# EAGLE design PCB-ATEM-GPITBO2 (EAGLE 6.5.0)

## Sheet 1 of 2
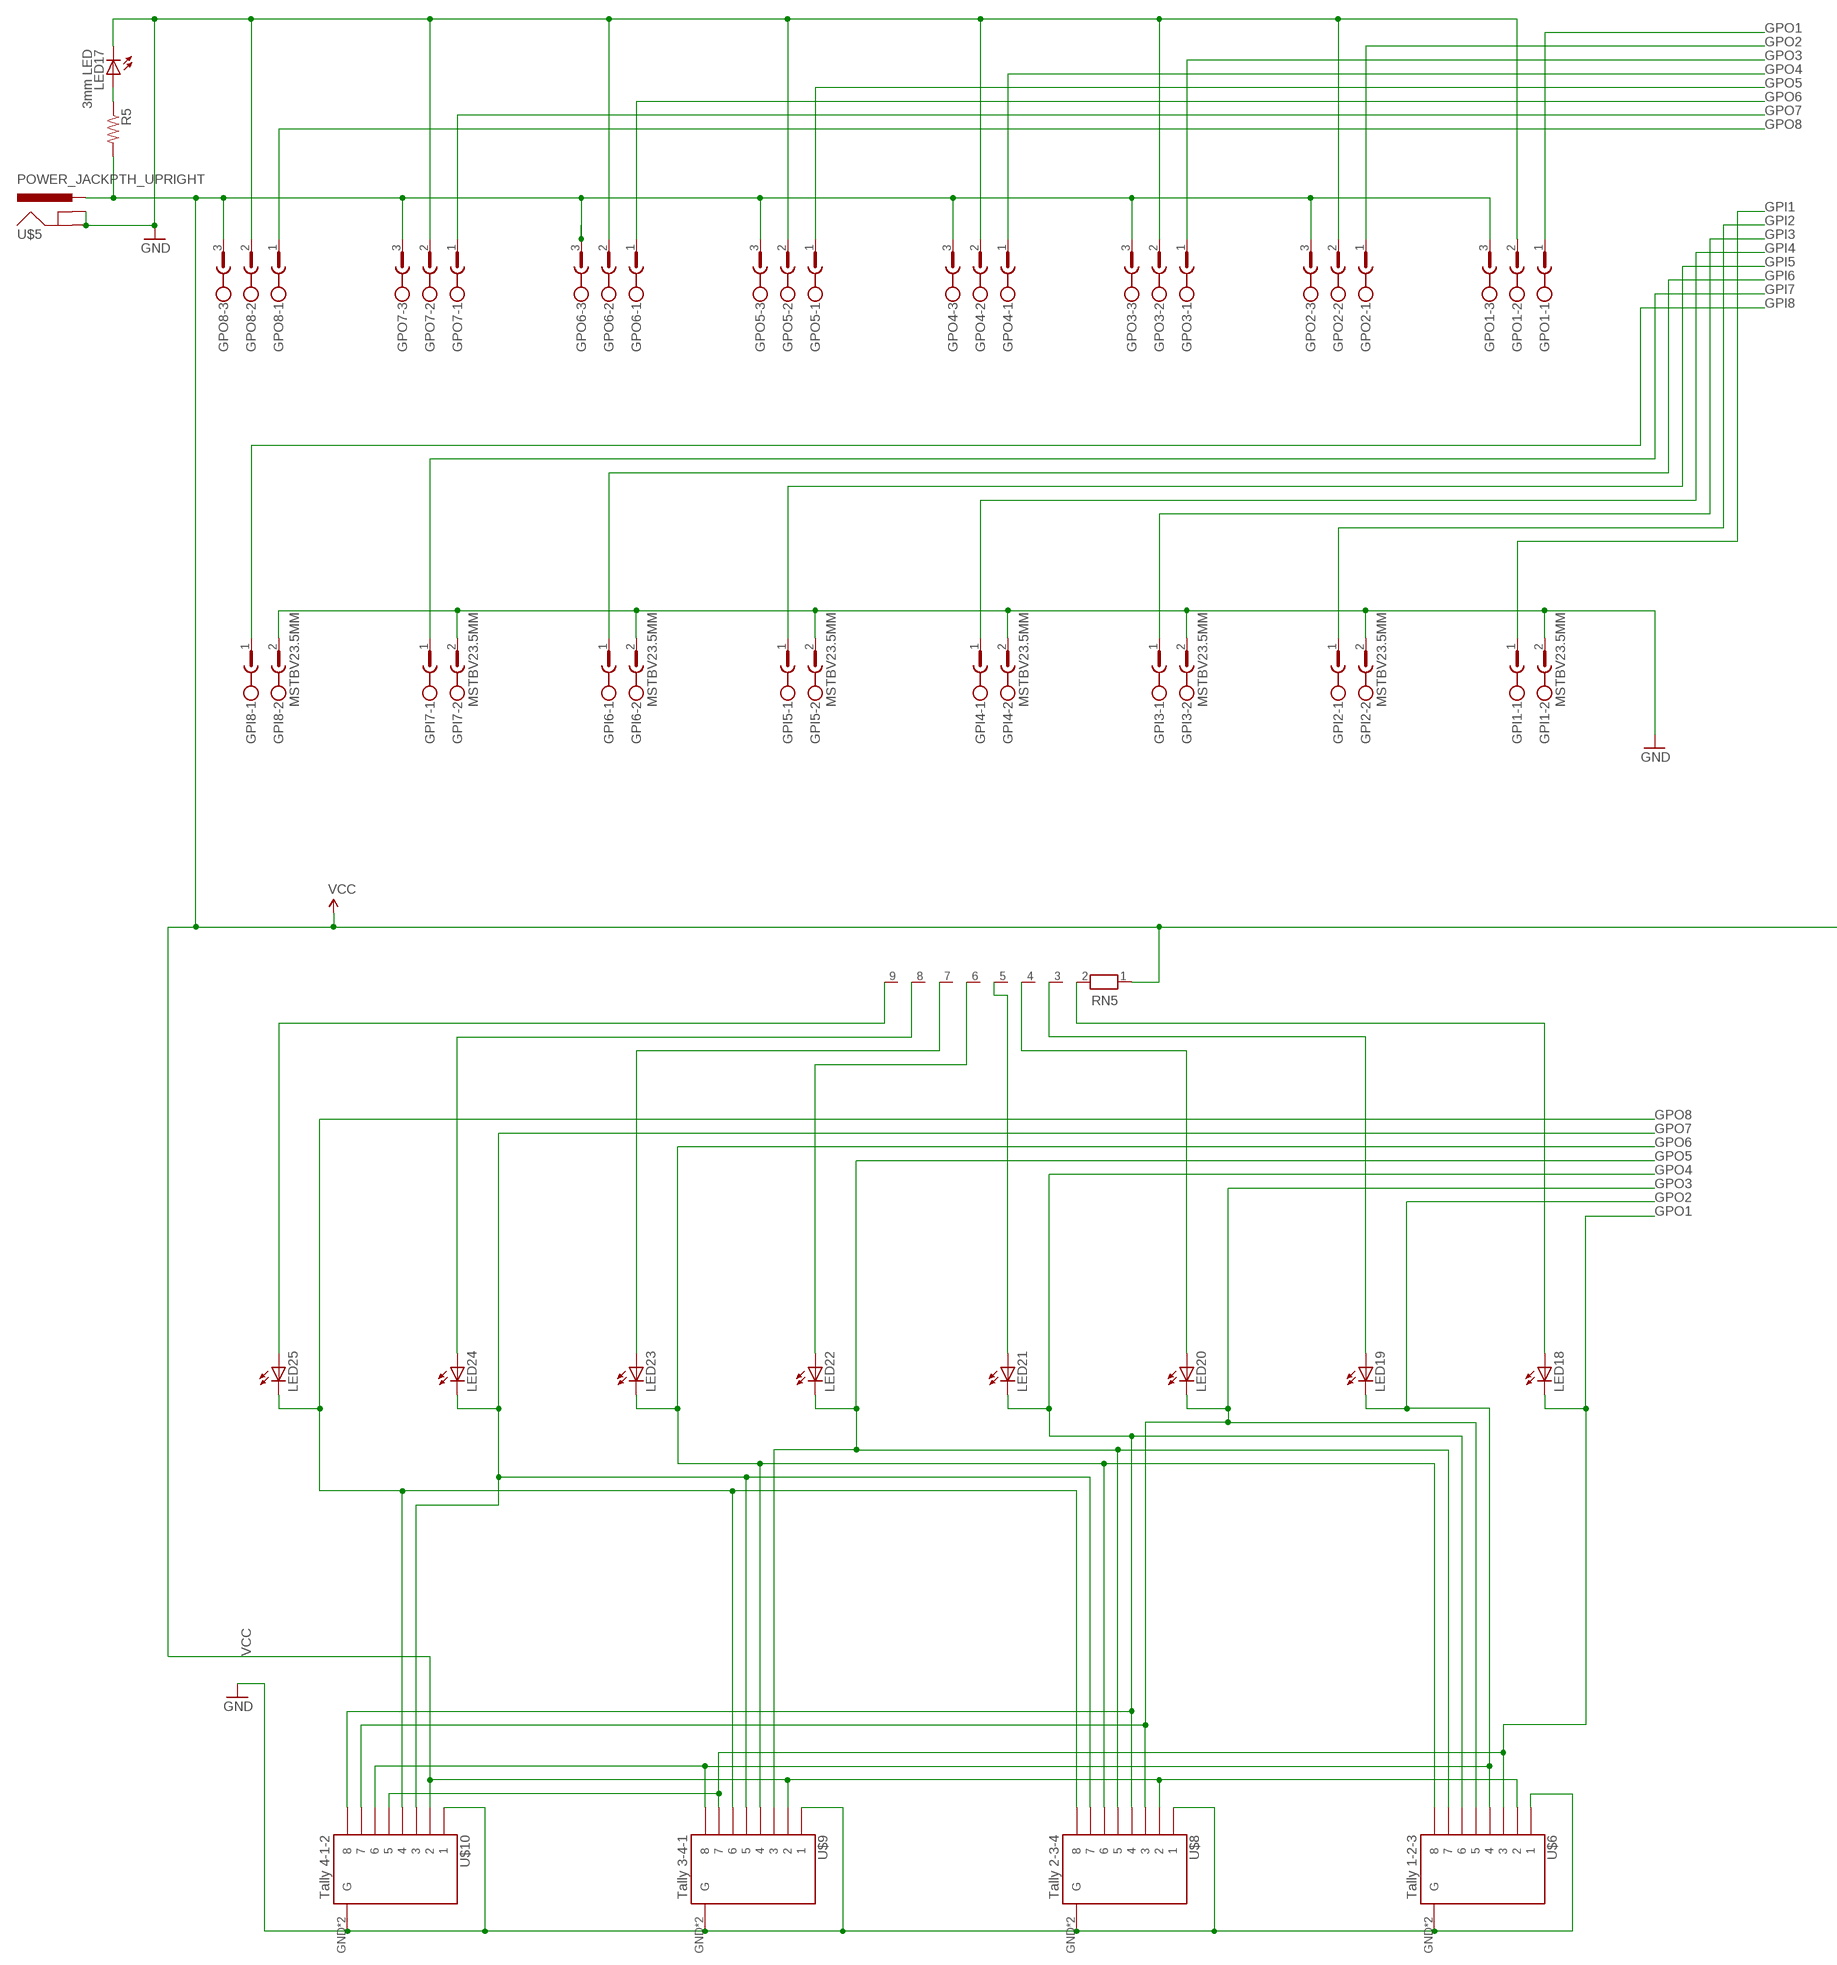
[diagram p0: schematic, sheet 1, part 1 of 2]
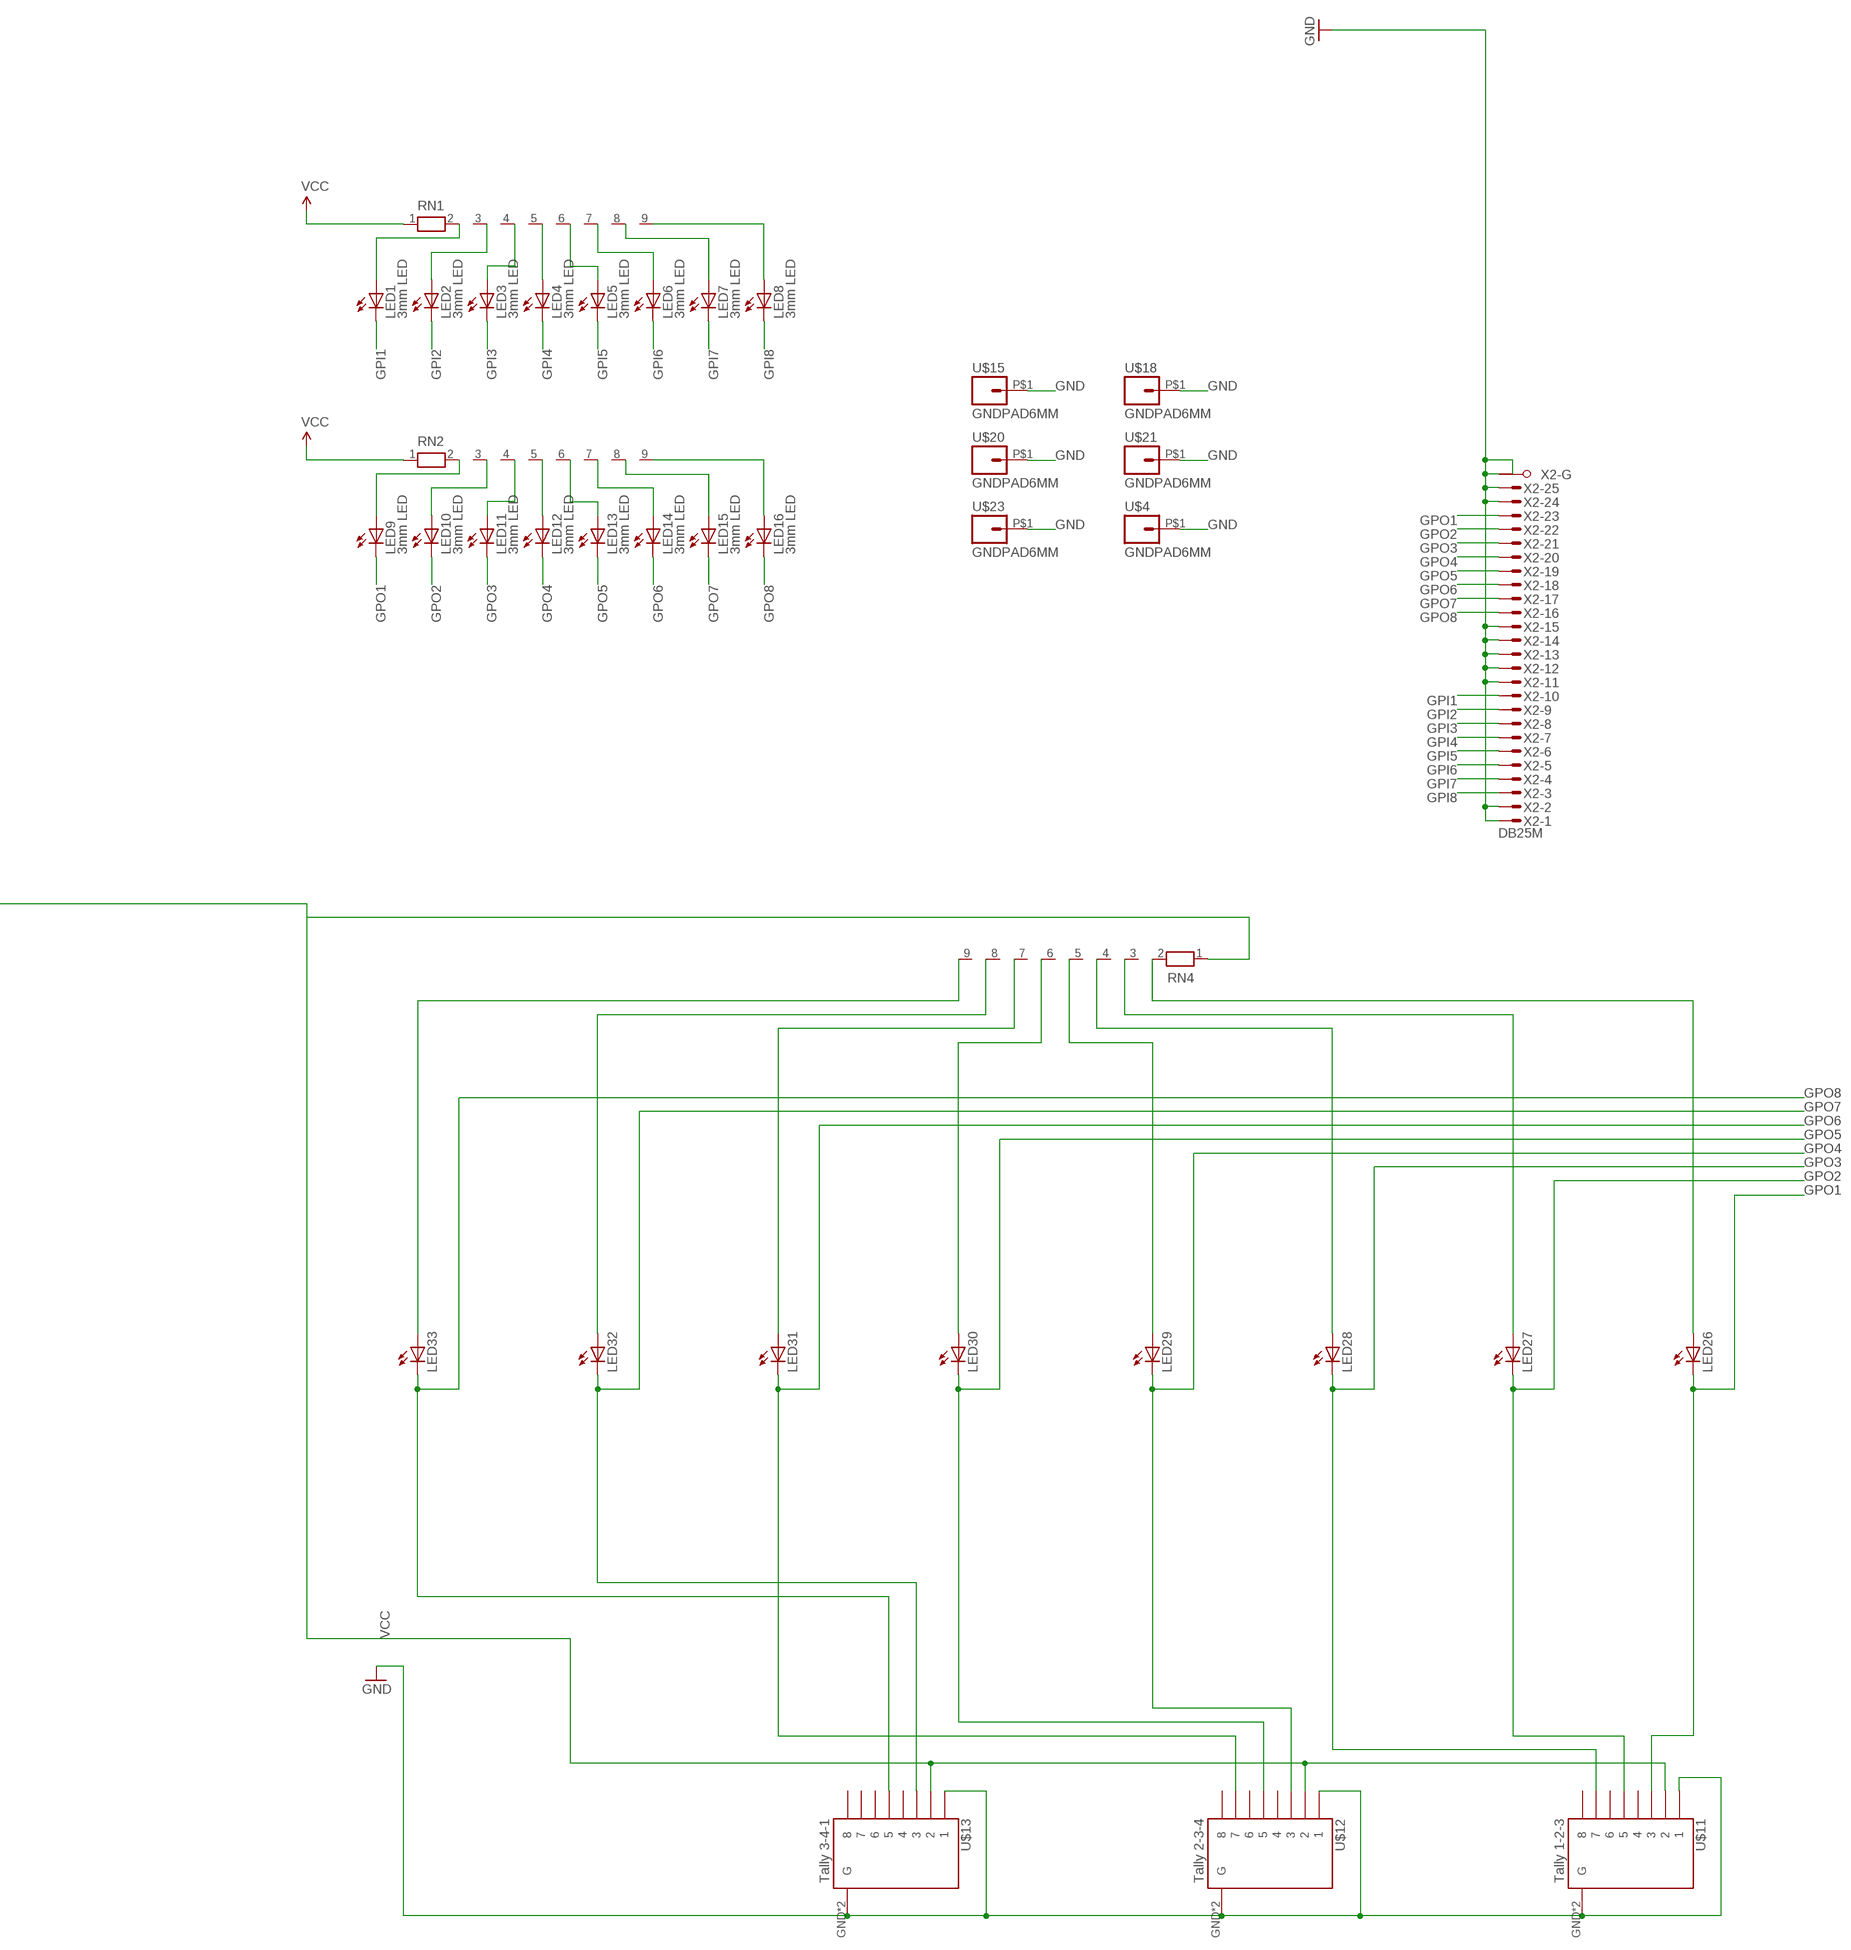
[diagram p1: schematic, sheet 1, part 2 of 2]

### Parts
GPI1  MSTBV23.5MM  [MSTBV2-3.5]
GPI2  MSTBV23.5MM  [MSTBV2-3.5]
GPI3  MSTBV23.5MM  [MSTBV2-3.5]
GPI4  MSTBV23.5MM  [MSTBV2-3.5]
GPI5  MSTBV23.5MM  [MSTBV2-3.5]
GPI6  MSTBV23.5MM  [MSTBV2-3.5]
GPI7  MSTBV23.5MM  [MSTBV2-3.5]
GPI8  MSTBV23.5MM  [MSTBV2-3.5]
GPO1  CON1  MSTBV33.5MM  [MSTBV3-3.5]
GPO2  CON1  MSTBV33.5MM  [MSTBV3-3.5]
GPO3  CON1  MSTBV33.5MM  [MSTBV3-3.5]
GPO4  CON1  MSTBV33.5MM  [MSTBV3-3.5]
GPO5  CON1  MSTBV33.5MM  [MSTBV3-3.5]
GPO6  CON1  MSTBV33.5MM  [MSTBV3-3.5]
GPO7  CON1  MSTBV33.5MM  [MSTBV3-3.5]
GPO8  CON1  MSTBV33.5MM  [MSTBV3-3.5]
LED1  3mm LED  LED3MM  [LED3MM]
LED2  3mm LED  LED3MM  [LED3MM]
LED3  3mm LED  LED3MM  [LED3MM]
LED4  3mm LED  LED3MM  [LED3MM]
LED5  3mm LED  LED3MM  [LED3MM]
LED6  3mm LED  LED3MM  [LED3MM]
LED7  3mm LED  LED3MM  [LED3MM]
LED8  3mm LED  LED3MM  [LED3MM]
LED9  3mm LED  LED3MM  [LED3MM]
LED10  3mm LED  LED3MM  [LED3MM]
LED11  3mm LED  LED3MM  [LED3MM]
LED12  3mm LED  LED3MM  [LED3MM]
LED13  3mm LED  LED3MM  [LED3MM]
LED14  3mm LED  LED3MM  [LED3MM]
LED15  3mm LED  LED3MM  [LED3MM]
LED16  3mm LED  LED3MM  [LED3MM]
LED17  3mm LED  LED3MM  [LED3MM]
LED18  LED3MM  [LED3MM]
LED19  LED3MM  [LED3MM]
LED20  LED3MM  [LED3MM]
LED21  LED3MM  [LED3MM]
LED22  LED3MM  [LED3MM]
LED23  LED3MM  [LED3MM]
LED24  LED3MM  [LED3MM]
LED25  LED3MM  [LED3MM]
LED26  LED3MM  [LED3MM]
LED27  LED3MM  [LED3MM]
LED28  LED3MM  [LED3MM]
LED29  LED3MM  [LED3MM]
LED30  LED3MM  [LED3MM]
LED31  LED3MM  [LED3MM]
LED32  LED3MM  [LED3MM]
LED33  LED3MM  [LED3MM]
R5  RESISTOR0603-RES  [0603-RES]
RN1  RN08  [RN-9]
RN2  RN08  [RN-9]
RN4  RN08  [RN-9]
RN5  RN08  [RN-9]
U$4  GNDPAD6MM  [3.2MMPAD6MM]
U$5  POWER_JACKPTH_UPRIGHT  [POWER_JACK_PTH_UPRIGHT]
U$6  Tally 1-2-3  RJ45-8_GNDUPRIGHT  [RJ45-8_GND_UPRIGHT]
U$8  Tally 2-3-4  RJ45-8_GNDUPRIGHT  [RJ45-8_GND_UPRIGHT]
U$9  Tally 3-4-1  RJ45-8_GNDUPRIGHT  [RJ45-8_GND_UPRIGHT]
U$10  Tally 4-1-2  RJ45-8_GNDUPRIGHT  [RJ45-8_GND_UPRIGHT]
U$11  Tally 1-2-3  RJ45-8_GNDUPRIGHT  [RJ45-8_GND_UPRIGHT]
U$12  Tally 2-3-4  RJ45-8_GNDUPRIGHT  [RJ45-8_GND_UPRIGHT]
U$13  Tally 3-4-1  RJ45-8_GNDUPRIGHT  [RJ45-8_GND_UPRIGHT]
U$15  GNDPAD6MM  [3.2MMPAD6MM]
U$18  GNDPAD6MM  [3.2MMPAD6MM]
U$20  GNDPAD6MM  [3.2MMPAD6MM]
U$21  GNDPAD6MM  [3.2MMPAD6MM]
U$23  GNDPAD6MM  [3.2MMPAD6MM]
X2  DB25M  M25HPS  [M25HP]

### Nets
GND [PWR]: GPI1.2 GPI2.2 GPI3.2 GPI4.2 GPI5.2 GPI6.2 GPI7.2 GPI8.2 GPO1.2 GPO2.2 GPO3.2 GPO4.2 GPO5.2 GPO6.2 GPO7.2 GPO8.2 LED17.K(C) U$4.P$1 U$5.GND U$5.SHUNT(GNDBREAK) U$6.1 U$6.GND1(G) U$6.GND(G) U$8.1 U$8.GND1(G) U$8.GND(G) U$9.1 U$9.GND1(G) U$9.GND(G) U$10.1 U$10.GND1(G) U$10.GND(G) U$11.1 U$11.GND1(G) U$11.GND(G) U$12.1 U$12.GND1(G) U$12.GND(G) U$13.1 U$13.GND1(G) U$13.GND(G) U$15.P$1 U$18.P$1 U$20.P$1 U$21.P$1 U$23.P$1 X2.1(-1:M) X2.2(-2:M) X2.11(-11:M) X2.12(-12:M) X2.13(-13:M) X2.14(-14:M) X2.15(-15:M) X2.24(-24:M) X2.25(-25:M) X2.G1(-G:G1) X2.G2(-G:G2)
GPI1 [INput lines]: GPI1.1 LED1.K(C) X2.10(-10:M)
GPI2 [INput lines]: GPI2.1 LED2.K(C) X2.9(-9:M)
GPI3 [INput lines]: GPI3.1 LED3.K(C) X2.8(-8:M)
GPI4 [INput lines]: GPI4.1 LED4.K(C) X2.7(-7:M)
GPI5 [INput lines]: GPI5.1 LED5.K(C) X2.6(-6:M)
GPI6 [INput lines]: GPI6.1 LED6.K(C) X2.5(-5:M)
GPI7 [INput lines]: GPI7.1 LED7.K(C) X2.4(-4:M)
GPI8 [INput lines]: GPI8.1 LED8.K(C) X2.3(-3:M)
GPO1 [RELAY LINES]: GPO1.1 LED9.K(C) LED18.K(C) LED26.K(C) U$6.3 U$9.7 U$10.5 U$11.3 X2.23(-23:M)
GPO2 [RELAY LINES]: GPO2.1 LED10.K(C) LED19.K(C) LED27.K(C) U$6.4 U$9.8 U$10.6 U$11.5 X2.22(-22:M)
GPO3 [RELAY LINES]: GPO3.1 LED11.K(C) LED20.K(C) LED28.K(C) U$6.5 U$8.3 U$10.7 U$11.7 X2.21(-21:M)
GPO4 [RELAY LINES]: GPO4.1 LED12.K(C) LED21.K(C) LED29.K(C) U$6.6 U$8.4 U$10.8 U$12.3 X2.20(-20:M)
GPO5 [RELAY LINES]: GPO5.1 LED13.K(C) LED22.K(C) LED30.K(C) U$6.7 U$8.5 U$9.3 U$12.5 X2.19(-19:M)
GPO6 [RELAY LINES]: GPO6.1 LED14.K(C) LED23.K(C) LED31.K(C) U$6.8 U$8.6 U$9.4 U$12.7 X2.18(-18:M)
GPO7 [RELAY LINES]: GPO7.1 LED15.K(C) LED24.K(C) LED32.K(C) U$8.7 U$9.5 U$10.3 U$13.3 X2.17(-17:M)
GPO8 [RELAY LINES]: GPO8.1 LED16.K(C) LED25.K(C) LED33.K(C) U$8.8 U$9.6 U$10.4 U$13.5 X2.16(-16:M)
N$1: LED1.A RN1.2
N$2: LED2.A RN1.3
N$4: LED18.A RN5.2
N$6: LED3.A RN1.4
N$9: LED19.A RN5.3
N$10: LED4.A RN1.5
N$13: LED20.A RN5.4
N$14: LED5.A RN1.6
N$15: LED6.A RN1.7
N$16: LED7.A RN1.8
N$17: LED21.A RN5.5
N$18: LED8.A RN1.9
N$19: LED9.A RN2.2
N$20: LED10.A RN2.3
N$21: LED22.A RN5.6
N$22: LED11.A RN2.4
N$23: LED12.A RN2.5
N$24: LED13.A RN2.6
N$25: LED23.A RN5.7
N$26: LED14.A RN2.7
N$27: LED15.A RN2.8
N$28: LED16.A RN2.9
N$29: LED24.A RN5.8
N$30: LED17.A R5.1
N$31: LED25.A RN5.9
N$32: LED26.A RN4.2
N$33: LED27.A RN4.3
N$41: LED28.A RN4.4
N$42: LED29.A RN4.5
N$43: LED30.A RN4.6
N$44: LED31.A RN4.7
N$46: LED32.A RN4.8
N$47: LED33.A RN4.9
VCC: GPO1.3 GPO2.3 GPO3.3 GPO4.3 GPO5.3 GPO6.3 GPO7.3 GPO8.3 R5.2 RN1.1 RN2.1 RN4.1 RN5.1 U$5.PWR U$6.2 U$8.2 U$9.2 U$10.2 U$11.2 U$12.2 U$13.2
Unconnected: U$11.4 U$11.6 U$11.8 U$12.4 U$12.6 U$12.8 U$13.4 U$13.6 U$13.7 U$13.8

## Sheet 2 of 2

## Library data of the parts
GPI1-GPI8 = SKAARHOJ:MSTBV2: PHOENIX
GPO1-GPO8 = SKAARHOJ:MSTBV3: PHOENIX
LED1-LED17 = SKAARHOJ:LED: KINGBRIGHT 20MM BIG LAMP
LED18-LED33 = led:LED: LED OSRAM: - CHIPLED LG R971, LG N971, LY N971, LG Q971, LY Q971, LO R971, LY R971 LH N974, LH R974 LS Q976, LO Q976, LY Q976 LO Q996 - Hyper CHIPLED LW Q18S LB Q993, LB Q99A, LB R99A - SideLED LS A670, LO A670, LY A670, LG A670, LP A670 LB A673, LV A673, LT A673, LW A673 LH A674 LY A675 LS A676, LA A676, LO A676, LY A676, LW A676 LS A679, LY A679, LG A679 - Hyper Micro SIDELED® LS Y876, LA Y876, LO Y876, LY Y876 LT Y87S - SmartLED LW L88C, LW L88S LB L89C, LB L89S, LG L890 LS L89K, LO L89K, LY L89K LS L896, LA L896, LO L896, LY L896 - TOPLED LS T670, LO T670, LY T670, LG T670, LP T670 LSG T670, LSP T670, LSY T670, LOP T670, LYG T670 LG T671, LOG T671, LSG T671 LB T673, LV T673, LT T673, LW T673 LH T674 LS T676, LA T676, LO T676, LY T676, LB T676, LH T676, LSB T676, LW T676 LB T67C, LV T67C, LT T67C, LS T67K, LO T67K, LY T67K, LW E67C LS E67B, LA E67B, LO E67B, LY E67B, LB E67C, LV E67C, LT E67C LW T67C LS T679, LY T679, LG T679 LS T770, LO T770, LY T770, LG T770, LP T770 LB T773, LV T773, LT T773, LW T773 LH T774 LS E675, LA E675, LY E675, LS T675 LS T776, LA T776, LO T776, LY T776, LB T776 LHGB T686 LT T68C, LB T68C - Hyper Mini TOPLED® LB M676 - Mini TOPLED Santana® LG M470 LS M47K, LO M47K, LY M47K Source: http://www.osram.convergy.de LUXEON: - LUMILED® LXK2-PW12-R00, LXK2-PW12-S00, LXK2-PW14-U00, LXK2-PW14-V00 LXK2-PM12-R00, LXK2-PM12-S00, LXK2-PM14-U00 LXK2-PE12-Q00, LXK2-PE12-R00, LXK2-PE12-S00, LXK2-PE14-T00, LXK2-PE14-U00 LXK2-PB12-K00, LXK2-PB12-L00, LXK2-PB12-M00, LXK2-PB14-N00, LXK2-PB14-P00, LXK2-PB14-Q00 LXK2-PR12-L00, LXK2-PR12-M00, LXK2-PR14-Q00, LXK2-PR14-R00 LXK2-PD12-Q00, LXK2-PD12-R00, LXK2-PD12-S00 LXK2-PH12-R00, LXK2-PH12-S00 LXK2-PL12-P00, LXK2-PL12-Q00, LXK2-PL12-R00 Source: www.luxeon.com KINGBRIGHT: KA-3528ASYC Source: www.kingbright.com
R5 = SparkFun:RESISTOR: Resistor Basic schematic elements and footprints for 0603, 1206, and PTH resistors.
RN1 RN2 RN4 RN5 = SKAARHOJ:RN08: RESISTOR NETWORK; OC_FARNELL: unknown; OC_NEWARK: unknown
U$4 U$15 U$18 U$20 U$21 U$23 = SKAARHOJ:GNDPAD
U$5 = SKAARHOJ:POWER_JACK: RASM712PX Right Angle SMT Mount DC Power Jack, pin size 0.100"(2.5mm), with locating post Switchcraft.com
U$6 U$8-U$13 = SKAARHOJ:RJ45-8_GND
X2 = con-subd:M25HPS: SUB-D; OC_FARNELL: unknown; OC_NEWARK: unknown

## Net classes
0 default: width 0.305 mm, drill 0.406 mm, clearance 0.203 mm
1 PWR: width 0.508 mm, drill 0.61 mm, clearance 0.203 mm
2 RELAY LINES: width 0.508 mm, drill 0.61 mm, clearance 0.406 mm
3 INput lines: width 0.305 mm, drill 0.406 mm, clearance 0.305 mm

## Board
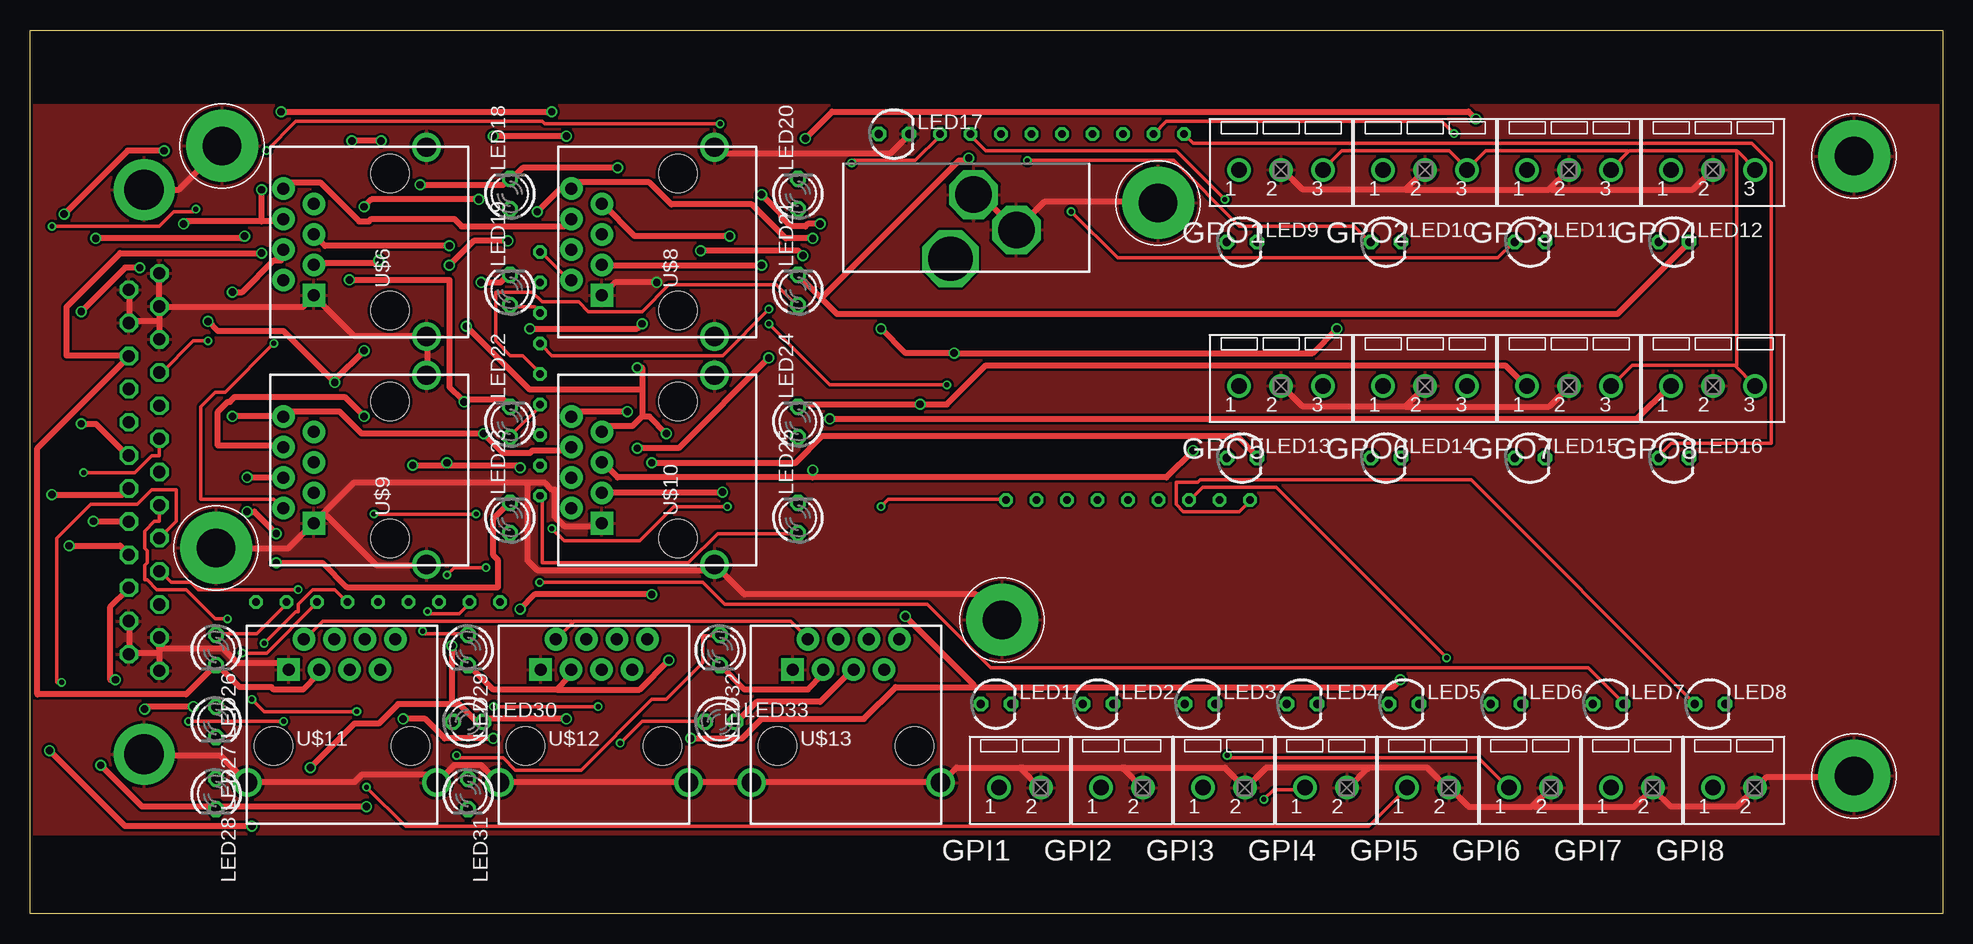
[diagram p2: board, top side]
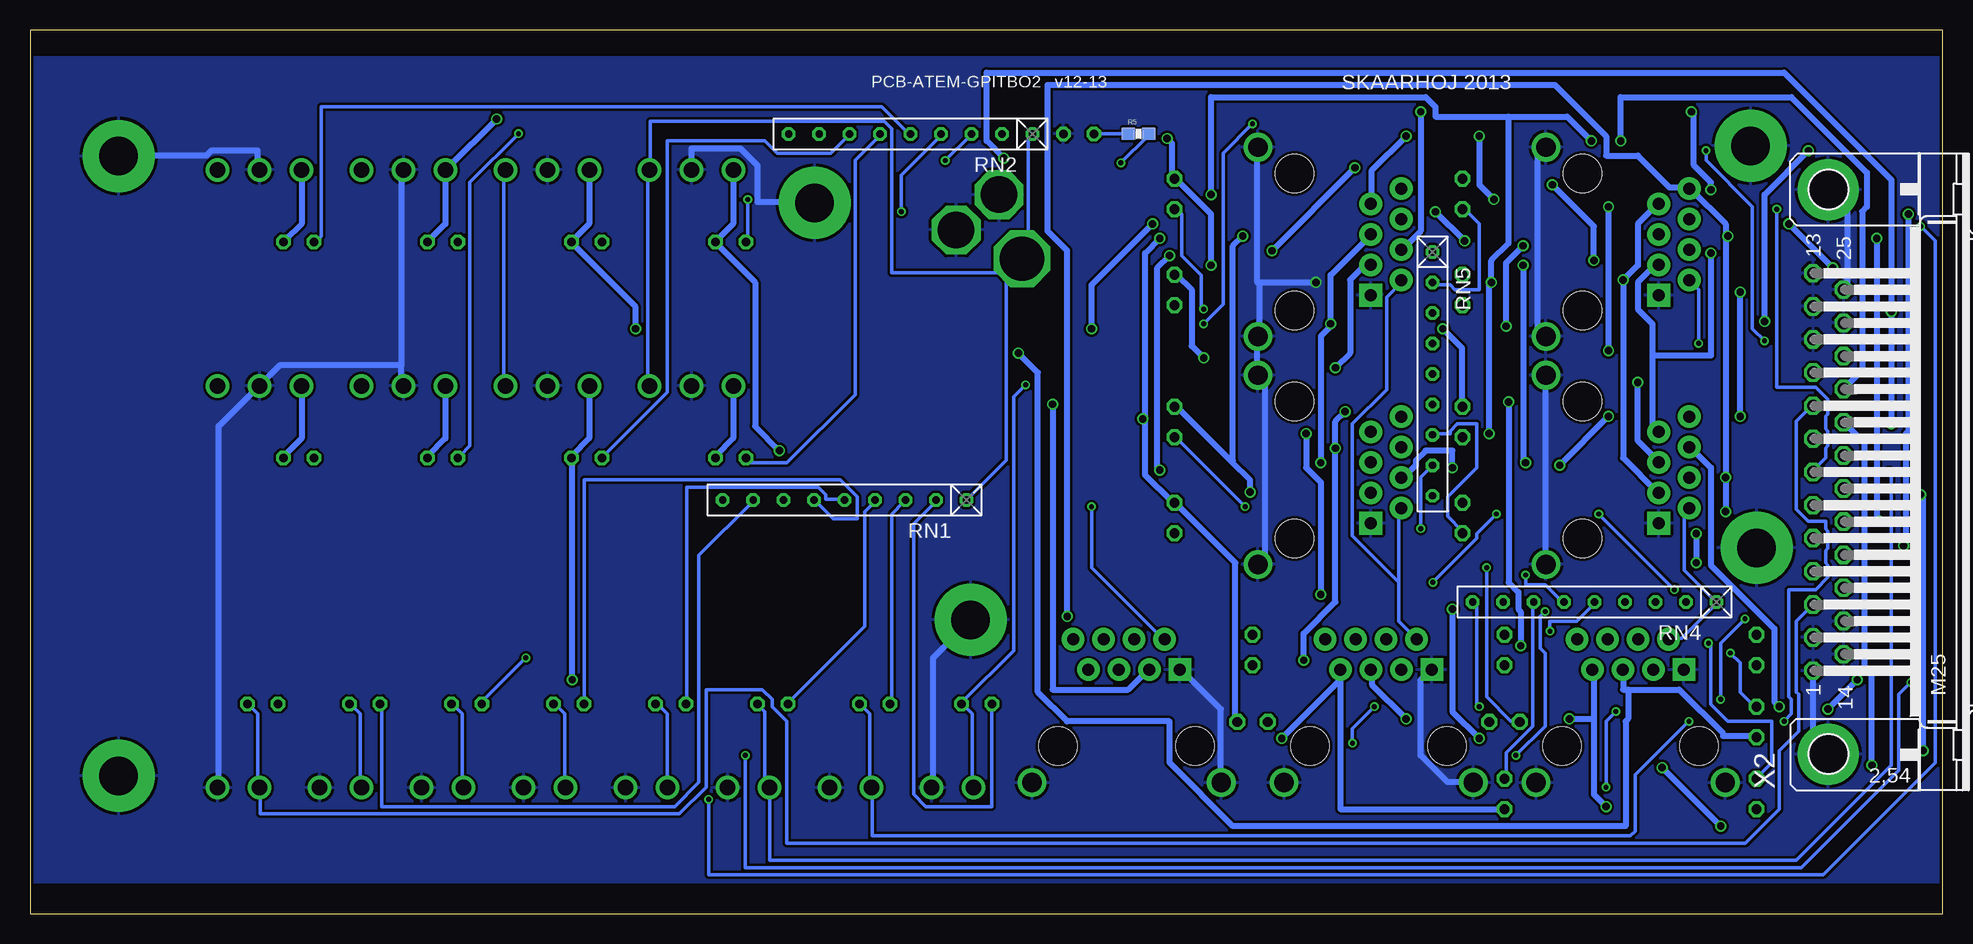
[diagram p3: board, bottom side, seen from below]

Size 159.38 x 73.66 mm. Coordinates in mm from the lower left corner, seen from the top.
Outline: 0,0 0,73.66 159.38,73.66 159.38,0 0,0
Copper layers (1*16): Top 0.035mm / dielectric 1.5mm / Bottom 0.035mm
Design rules "Fusion_eagle_rule_v1.1": minimum track width 6mil, minimum drill 12mil, track to track 6mil, track to pad 6mil, pad to pad 6mil, via to via 6mil, smd to smd 0mil, copper to edge 10mil, drill to drill 10mil, minimum pad ring 10mil, minimum via ring 6mil, stop-mask expansion 2mil, vias tented up to drill 100mil, thermal gap 10mil
tRestrict: area 0,0 to 160,6.5; area 0,67.5 to 160,74
bRestrict: area 0,71.5 to 160,74; area 0,0 to 160,2.5

### Footprints (pad centres in the part's own frame; a part is rotated, then mirrored left to right if it is on the bottom)
MSTBV2-3.5 = drill 1.3: 1 -1.75,0.02; 2 1.75,0.02
MSTBV3-3.5 = drill 1.3: 1 -3.5,0; 2 0,0; 3 3.5,0
LED3MM = drill 0.7 pad 1.2 octagon: A -1.27,0; K 1.27,0
LED3MM' = drill 0.813 octagon: A -1.27,0; K 1.27,0
0603-RES = smd 1.1 x 1: 1 -0.85,0; 2 0.85,0
RN-9 = drill 0.6 octagon: 1 -10.16,0; 2 -7.62,0; 3 -5.08,0; 4 -2.54,0; 5 0,0; 6 2.54,0; 7 5.08,0; 8 7.62,0; 9 10.16,0
3.2MMPAD6MM = drill 3.2 pad 6: P$1 0,0
POWER_JACK_PTH_UPRIGHT = drill 3.048 octagon: GND -1,-4.2; SHUNT 1.935,-0.63 | drill 3.7 octagon: PWR -3.4,1.3
RJ45-8_GND_UPRIGHT = drill 1 pad 1.88 square: 1 -4.445,6.35 | drill 1 pad 1.88: 2 -3.175,8.89; 3 -1.905,6.35; 4 -0.635,8.89; 5 0.635,6.35; 6 1.905,8.89; 7 3.175,6.35; 8 4.445,8.89 | drill 1.6: GND -7.88,-3.05; GND1 7.88,-3.05 | hole 3.2: -5.715,0; 5.715,0
M25HP = drill 1.016 octagon: 1 -16.561,1.27; 2 -13.792,1.27; 3 -11.049,1.27; 4 -8.28,1.27; 5 -5.512,1.27; 6 -2.769,1.27; 7 0,1.27; 8 2.769,1.27; 9 5.512,1.27; 10 8.28,1.27; 11 11.049,1.27; 12 13.792,1.27; 13 16.561,1.27; 14 -15.189,-1.27; 15 -12.421,-1.27; 16 -9.652,-1.27; 17 -6.909,-1.27; 18 -4.14,-1.27; 19 -1.372,-1.27; 20 1.372,-1.27; 21 4.14,-1.27; 22 6.909,-1.27; 23 9.652,-1.27; 24 12.421,-1.27; 25 15.189,-1.27 | drill 3.302 pad 5.08: G1 -23.52,0; G2 23.52,0

### Placement (x,y rotation side)
GPI1  82.5,10.5 0 top
GPI2  91,10.5 0 top
GPI3  99.5,10.5 0 top
GPI4  108,10.5 0 top
GPI5  116.5,10.5 0 top
GPI6  125,10.5 0 top
GPI7  133.5,10.5 0 top
GPI8  142,10.5 0 top
GPO1  104.25,62 0 top
GPO2  116.25,62 0 top
GPO3  128.25,62 0 top
GPO4  140.25,62 0 top
GPO5  104.25,44 0 top
GPO6  116.25,44 0 top
GPO7  128.25,44 0 top
GPO8  140.25,44 0 top
LED1  80.5,17.5 0 top
LED2  89,17.5 0 top
LED3  97.5,17.5 0 top
LED4  106,17.5 0 top
LED5  114.5,17.5 0 top
LED6  123,17.5 0 top
LED7  131.5,17.5 0 top
LED8  140,17.5 0 top
LED9  101,56 0 top
LED10  113,56 0 top
LED11  125,56 0 top
LED12  137,56 0 top
LED13  101,38 0 top
LED14  113,38 0 top
LED15  125,38 0 top
LED16  137,38 0 top
LED17  72,65 0 top
LED18  [LED3MM']  40,60 90 top
LED19  [LED3MM']  40,52 90 top
LED20  [LED3MM']  64,60 90 top
LED21  [LED3MM']  64,52 90 top
LED22  [LED3MM']  40,41 90 top
LED23  [LED3MM']  40,33 90 top
LED24  [LED3MM']  64,41 90 top
LED25  [LED3MM']  64,33 90 top
LED26  [LED3MM']  15.5,22 270 top
LED27  [LED3MM']  15.5,16 270 top
LED28  [LED3MM']  15.5,10 270 top
LED29  [LED3MM']  36.5,22 270 top
LED30  [LED3MM']  36.5,16 0 top
LED31  [LED3MM']  36.5,10 270 top
LED32  [LED3MM']  57.5,22 270 top
LED33  [LED3MM']  57.5,16 0 top
R5  67,65 0 bottom
RN1  91.5,34.5 180 bottom
RN2  86,65 180 bottom
RN4  29,26 180 bottom
RN5  42.5,45 270 bottom
U$4  94,59.25 0 top
U$5  78,58 90 top
U$6  30,56 90 top
U$8  54,56 90 top
U$9  30,37 90 top
U$10  54,37 90 top
U$11  26,14 0 top
U$12  47,14 0 top
U$13  68,14 0 top
U$15  152,11.5 0 top
U$18  152,63.16 0 top
U$20  15.5,30.5 0 top
U$21  16,64 0 top
U$23  81,24.5 0 top
X2  9.51,36.83 90 bottom

### Tracks (layer width: path | path; a pad name or v marks a point on that pad's centre or on a via)
GND  (via drill 0.61)
  Top 0.508: LED17.K 73.15,64.82 71.73,63.4 57.51,63.4 57.1,63.8 U$8.GND1 | v52.22,52.63 48.77,52.63 47.75,51.61 U$8.1 | U$9.1 23.57,32.51 21.54,30.48 15.65,30.48 U$20.P$1 | 41.45,35.97 27.03,35.97 23.77,32.72 U$9.1 | 41.45,35.97 42.88,35.97 43.48,35.36 43.69,35.36 43.69,33.12 44.5,32.31 47.35,32.31 47.55,32.51 U$10.1 | U$9.GND 32.92,29.06 28.85,29.06 24.59,33.33 U$9.1 | U$9.GND1 33.12,44.91 33.12,47.95 U$6.GND 32.92,48.16 27.03,48.16 23.77,51.41 U$6.1 23.57,51.41 22.76,50.6 10.97,50.6 X2.12 | 10.77,49.38 10.77,50.6 X2.12 | 10.77,49.38 10.77,47.95 X2.11 | 10.77,49.38 8.33,49.38 X2.24 8.33,49.58 8.33,52.02 X2.25 | X2.13 10.77,53.24 10.77,50.8 X2.12 | X2.G2 12.39,60.35 15.85,63.8 U$21.P$1 | 41.45,35.97 41.45,29.46 42.27,28.65 56.49,28.65 56.9,29.06 U$10.GND 57.1,29.06 59.54,26.62 78.84,26.62 80.87,24.59 U$23.P$1 | U$5.SHUNT 78.64,59.74 79.45,59.74 82.09,57.1 U$5.GND 82.3,57.1 84.53,59.33 93.88,59.33 U$4.P$1 | 114.61,42.27 106.07,42.27 104.44,43.89 GPO5.2 | 114.61,42.27 116.23,43.89 GPO6.2 | 114.61,42.27 126.59,42.27 128.22,43.89 GPO7.2 | 114.61,60.35 106.07,60.35 104.44,61.98 GPO1.2 | 114.61,60.35 116.23,61.98 GPO2.2 | 126.69,60.45 126.59,60.35 114.61,60.35 | 126.69,60.45 128.22,61.98 GPO3.2 | GPO4.2 140.21,61.98 138.58,60.35 126.8,60.35 126.69,60.45 | 10.77,22.15 10.77,22.96 X2.2 | 10.77,22.15 10.77,21.74 | 10.77,21.74 10.77,20.32 X2.1 | 10.77,21.74 8.33,21.74 X2.14 8.33,21.95 8.33,24.38 X2.15 | 10.77,22.15 16.05,22.15 17.27,20.93 21.13,20.93 21.54,20.52 U$11.1 | X2.G1 9.55,13.21 15.85,13.21 18.09,10.97 U$11.GND 18.29,10.97 27.03,10.97 27.64,11.58 34.34,11.58 U$11.GND1 33.93,10.97 35.36,12.39 37.59,12.39 39.01,10.97 U$12.GND 39.22,10.97 54.66,10.97 U$12.GND1 55.07,10.97 59.94,10.97 U$13.GND 60.35,10.97 75.79,10.97 U$13.GND1 76,10.97 77.22,12.19 82.5,12.19 82.6,12.09
  Top 0.508: 82.6,12.09 84.12,10.57 GPI1.2 | 91.14,12.09 91.03,12.19 82.7,12.19 82.6,12.09 | 91.14,12.09 92.66,10.57 GPI2.2 | 91.14,12.09 91.24,12.19 99.57,12.19 101.19,10.57 GPI3.2 101.4,10.57 103.02,12.19 111.35,12.19 111.45,12.09 | 111.45,12.09 111.56,12.19 116.43,12.19 118.06,10.57 GPI5.2 118.47,10.36 119.89,8.94 125.17,8.94 125.27,9.04 | 111.45,12.09 109.93,10.57 GPI4.2 | 125.27,9.04 126.59,10.36 GPI6.2 | 125.27,9.04 125.37,8.94 133.71,8.94 135.13,10.36 GPI7.2 135.33,10.36 136.75,8.94 142.24,8.94 143.66,10.36 GPI8.2 143.87,10.57 144.68,11.38 151.99,11.38 U$15.P$1
  Bottom 0.508: 56.9,52.63 v52.22,52.63 | 56.9,52.63 56.9,48.16 U$8.GND 57.1,47.95 57.1,45.11 U$10.GND1 56.9,44.7 56.49,44.3 56.49,29.67 56.9,29.26 U$10.GND | U$8.GND1 57.1,63.8 57.1,52.63 56.9,52.63 | U$6.GND1 33.12,63.8 33.73,63.2 33.73,48.77 33.12,48.16 U$6.GND | X2.25 8.13,52.02 7.92,52.22 7.92,58.93 9.35,60.35 X2.G2 | U$9.GND 33.12,29.26 33.12,44.7 U$9.GND1 | 128.42,45.72 138.58,45.72 140.21,44.09 GPO8.2 140.41,43.89 143.66,40.64 143.66,10.57 GPI8.2 | 128.42,45.72 128.42,44.09 GPO7.2 | U$18.P$1 151.99,63.2 144.68,63.2 144.27,63.6 140.41,63.6 140.41,62.18 GPO4.2 | 128.42,45.72 128.42,61.98 GPO3.2 | U$4.P$1 94.08,59.33 98.75,59.33 98.75,62.38 100.18,63.8 104.24,63.8 104.24,62.18 GPO1.2 | X2.1 10.77,20.12 10.77,14.63 9.55,13.41 X2.G1 | U$12.1 42.67,20.32 43.48,19.51 43.48,13.21 41.25,10.97 39.22,10.97 U$12.GND | U$13.1 63.4,20.32 60.15,17.07 60.15,10.97 U$13.GND | U$23.P$1 81.08,24.38 84.12,21.34 84.12,10.57 GPI1.2
  pour Top: 0,0 159,0 159,73 0,73
  pour Bottom: 0,0 159,0 159,73 0,73
GPI1  (via drill 0.41)
  Top 0.305: v14.83,47.75 13.61,47.75 10.97,45.11 X2.10 | v19.71,63.6 22.15,66.04 42.67,66.04 42.88,65.84 v57.51,65.84 | v61.57,49.17 66.65,44.09 v76.4,44.09
  Bottom 0.305: GPI1.1 80.87,10.57 80.87,16.66 81.69,17.48 LED1.K 81.69,17.68 77.42,21.95 77.42,43.08 v76.4,44.09 | v14.83,47.75 15.85,48.77 15.85,58.93 19.71,62.79 v19.71,63.6 | v57.51,65.84 59.94,63.4 59.94,50.8 v61.57,49.17
GPI2  (via drill 0.41)
  Top 0.305: v21.13,16.05 v13.21,16.05
  Bottom 0.305: LED2.K 90.22,17.48 89.41,16.66 89.41,10.57 GPI2.1 89.2,10.36 89.2,6.5 26.01,6.5 25.6,6.91 25.6,11.58 v21.13,16.05 | v13.21,16.05 12.6,16.66 12.6,17.88 12.8,18.09 12.8,27.03 10.57,27.03 9.55,28.04 9.55,29.06 9.75,29.26 9.75,30.28 9.55,30.48 9.55,31.9 9.75,32.11 9.75,32.72 11.18,32.72 12.19,33.73 12.19,41.05 10.97,42.27 X2.9
GPI3  (via drill 0.41)
  Top 0.305: v4.47,36.78 8.74,36.78 10.16,38.2 10.77,38.2 10.77,39.42 X2.8
  Bottom 0.305: LED3.K 98.75,17.48 98.15,16.87 98.15,10.77 97.94,10.57 GPI3.1 97.74,10.36 97.74,4.47 12.19,4.47 4.27,12.39 4.27,36.58 v4.47,36.78
GPI4  (via drill 0.41)
  Top 0.305: v13.82,58.73 13.61,58.52 11.99,58.52 10.77,57.3 v1.83,57.3 | v102.82,9.55 103.63,10.36 106.07,10.36 GPI4.1
  Bottom 0.305: LED4.K 107.09,17.48 106.27,16.66 106.27,10.57 GPI4.1 | v13.82,58.73 13.82,43.89 10.57,43.89 9.55,42.88 9.55,41.66 9.75,41.45 9.75,40.44 9.55,40.23 9.55,39.01 9.75,38.81 9.75,38 10.77,36.98 X2.7 | v1.83,57.3 0.61,56.08 0.61,12.6 9.96,3.25 102.82,3.25 v102.82,9.55
GPI5  (via drill 0.41)
  Top 0.305: v16.46,24.59 15.44,24.59 13.01,27.03 10.57,27.03 9.75,27.84 9.55,27.84 9.55,29.06 9.75,29.26 9.75,30.28 9.55,30.48 9.55,31.9 10.36,32.72 10.77,32.72 10.77,33.93 X2.6 | v18.49,17.88 19.51,16.87 v27.23,16.87 | v28.04,10.57 31.29,7.32 111.56,7.32 114.61,10.36 GPI5.1
  Bottom 0.305: LED5.K 115.62,17.48 114.81,16.66 114.81,10.57 GPI5.1 | v16.46,24.59 18.49,22.55 v18.49,17.88 | v27.23,16.87 28.04,16.05 v28.04,10.57
GPI6  (via drill 0.41)
  Top 0.305: v2.64,19.3 2.23,19.3 2.23,31.29 5.08,34.14 8.94,34.14 10.16,35.36 12.19,35.36 12.19,32.72 10.97,31.5 X2.5 | v99.77,13.21 99.97,13.01 120.7,13.01 123.14,10.57 GPI6.1
  Bottom 0.305: LED6.K 124.16,17.48 123.34,16.66 123.34,10.57 GPI6.1 | v2.64,19.3 3.66,18.29 3.66,11.99 11.79,3.86 99.77,3.86 v99.77,13.21
GPI7  (via drill 0.41)
  Top 0.305: v22.35,27.03 14.02,27.03 13.41,27.64 11.79,27.64 10.97,28.45 X2.4 | v37.19,33.33 v28.65,33.33 | v42.47,27.64 56.08,27.64 57.91,25.81 74.78,25.81 80.06,20.52 129.84,20.52 132.69,17.68 LED7.K
  Bottom 0.305: LED7.K 132.69,17.48 131.88,16.66 131.88,10.57 GPI7.1 | v28.65,33.33 v22.35,27.03 | v37.19,33.33 38.81,31.7 38.81,31.29 v42.47,27.64
GPI8
  Bottom 0.305: LED8.K 141.22,17.48 140.41,16.66 140.41,10.57 GPI8.1 140.21,10.36 140.21,8.33 105.26,8.33 103.02,10.57 103.02,18.69 98.35,18.69 97.54,17.88 97.54,17.27 96.32,16.05 96.32,5.89 16.46,5.89 13.61,8.74 13.61,13.61 11.99,15.24 11.99,18.29 12.19,18.49 12.19,24.38 10.97,25.6 X2.3
GPO1  (via drill 0.61)
  Top 0.508: v32.51,60.76 39.42,60.76 39.83,61.16 LED18.K 40.23,61.37 41.05,62.18 v48.97,62.18 | v29.06,54.46 28.85,54.25 23.77,54.25 U$6.3 | U$11.3 23.98,20.32 23.98,19.91 22.76,18.69 20.32,18.69 20.12,18.9 17.48,18.9 15.65,20.73 LED26.K 15.44,20.52 15.24,20.52 13.01,18.29 0.61,18.29 0.61,38.81 8.13,46.33 X2.23 8.13,46.53 3.05,46.53 3.05,50.6 7.52,55.07 v19.3,55.07 | 65.23,36.37 94.69,36.37 v96.93,38.61 | 65.23,36.37 48.97,36.37 47.75,37.59 U$10.5 | v55.88,55.27 64.01,55.27 v64.41,54.86 | 65.23,36.37 v65.23,36.98
  Bottom 0.508: v32.51,60.76 29.06,57.3 v29.06,54.46 | 24.18,46.53 24.18,49.17 25.4,50.39 25.4,52.63 23.77,54.25 U$6.3 | 24.18,46.53 24.18,40.64 23.77,40.23 U$9.7 | 24.18,46.53 19.3,46.53 v19.3,55.07 | GPO1.1 100.79,61.98 100.79,57.51 102.21,56.08 LED9.K 102.21,55.88 98.96,52.63 98.96,40.64 v96.93,38.61 | v55.88,55.27 v48.97,62.18 | v64.41,54.86 65.43,53.85 65.43,37.19 v65.23,36.98
GPO2  (via drill 0.61)
  Top 0.508: v37.59,52.63 39.22,52.63 39.83,53.24 LED19.K | U$10.6 44.91,38.81 44.7,38.61 41.86,38.61 41.66,38.41 39.42,38.41 v37.8,40.03 27.64,40.03 25.81,41.86 21.54,41.86 21.13,41.45 U$9.8 20.93,41.45 v16.87,41.45 | v29.26,64.41 v26.82,64.41 | v16.87,51.82 17.68,51.82 20.32,54.46 20.93,54.46 20.93,55.27 U$6.4 | v108.92,48.77 106.88,46.74 v77.01,46.74 72.95,46.74 v70.92,48.77 | v60.96,59.94 62.59,58.32 62.59,58.12 63.4,57.3 64.62,57.3 64.82,57.51 v65.84,57.51
  Bottom 0.508: v37.8,40.03 37.8,52.43 v37.59,52.63 37.59,54.46 36.17,55.88 36.17,66.45 | v26.82,64.41 26.82,68.07 12.6,68.07 6.3,61.77 6.3,58.93 6.71,58.52 6.71,45.31 8.13,43.89 X2.22 | v29.26,64.41 31.29,66.45 36.17,66.45 | v16.87,41.45 v16.87,51.82 | GPO2.1 112.78,61.98 112.78,57.51 114.2,56.08 LED10.K 114.2,55.88 108.92,50.6 v108.92,48.77 | 26.21,18.69 26.62,18.69 26.62,20.32 U$11.5 | 26.21,18.69 21.95,18.69 18.29,15.04 18.29,14.83 15.65,14.83 LED27.K | v77.01,46.74 75.39,45.11 75.39,18.49 72.95,16.05 64.41,16.05 64.41,12.6 59.13,7.32 26.42,7.32 26.42,16.05 26.21,16.26 26.21,18.69 | 36.17,66.45 42.27,66.45 42.27,67.26 43.08,68.07 60.96,68.07 v60.96,59.94 | v65.84,57.51 70.92,52.43 v70.92,48.77
GPO3  (via drill 0.61)
  Top 0.508: v28.04,8.94 15.85,8.94 15.65,8.74 LED28.K 15.44,8.94 9.35,8.94 v5.89,12.39 | v60.96,54.05 47.75,54.05 U$8.3 | 51,41.45 50.19,40.64 48.16,40.64 47.75,40.23 U$10.7 | 51,43.69 51,45.52 v50.6,45.52 | 51,43.69 51,41.45 | v34.95,55.68 24.59,55.68 23.77,56.49 U$6.5 | v36.37,48.97 41.66,43.69 51,43.69 | v120.5,66.24 119.89,66.85 66.85,66.85 v64.62,64.62 | v31.09,16.26 32.92,16.26 34.54,14.63 v38.61,14.63 | v40.84,25.4 42.06,26.62 v51.82,26.62 | v53.03,40.03 51.61,41.45 51,41.45
  Bottom 0.508: v28.04,8.94 29.06,9.96 29.06,16.26 | 29.06,16.26 29.06,20.32 U$11.7 | v5.89,12.39 5.89,19.91 6.5,20.52 6.5,39.22 8.13,40.84 X2.21 | LED11.K 126.19,56.08 124.77,57.51 124.77,61.98 GPO3.1 124.56,62.18 v120.5,66.24 | v60.96,54.05 60.96,58.32 63.8,61.16 LED20.K 64.21,61.37 64.21,64.21 v64.62,64.62 | v50.6,45.52 49.38,46.74 49.38,52.83 48.16,54.05 47.75,54.05 U$8.3 | v34.95,55.68 36.37,54.25 v36.37,48.97 | v31.09,16.26 29.06,16.26 | v38.61,14.63 40.84,16.87 v40.84,25.4 | v51.82,26.62 51.82,35.97 53.03,37.19 v53.03,40.03
GPO4  (via drill 0.61)
  Top 0.508: v4.27,40.84 5.49,40.84 8.13,38.2 X2.20 | v4.27,50.19 7.92,53.85 v9.14,53.85 | v12.8,57.51 13.01,57.71 19.3,57.71 | 19.3,57.71 20.93,57.71 U$6.6 | v20.93,66.85 v43.48,66.85 | 19.3,57.71 v19.3,60.35 | 43.89,18.69 38.61,18.69 36.58,20.73 LED29.K | 43.89,18.69 44.91,19.71 44.91,20.32 U$12.3 | v49.78,41.86 45.52,41.86 U$10.8 | v53.24,21.13 50.8,18.69 43.89,18.69 | 65.94,51.31 67.26,49.99 132.28,49.99 138.18,55.88 LED12.K | 65.94,51.31 64.01,53.24 LED21.K | v50.6,38.81 54.05,38.81 v61.57,46.33 | v78.23,62.99 78.03,62.79 77.42,62.79 65.94,51.31
  Bottom 0.508: v4.27,40.84 v4.27,50.19 4.27,61.16 13.21,70.1 79.65,70.1 79.65,64.41 v78.23,62.99 | v12.8,57.51 v9.14,53.85 | v43.48,66.85 43.48,56.9 44.91,55.47 U$8.4 | v20.93,66.85 20.73,66.65 20.73,62.38 19.3,60.96 v19.3,60.35 | v49.78,41.86 50.6,41.05 v50.6,38.81 50.6,26.01 53.24,23.37 v53.24,21.13 | LED12.K 138.18,56.08 136.75,57.51 136.75,61.98 GPO4.1 | v61.57,46.33 62.59,47.35 62.59,52.02 63.8,53.24 LED21.K
GPO5  (via drill 0.61)
  Top 0.508: v44.7,16.26 38,16.26 37.8,16.05 LED30.K 37.59,16.05 37.19,16.05 35.76,17.48 35.15,17.48 | v1.83,34.95 7.72,34.95 8.13,35.36 X2.19 | v1.63,13.61 7.92,7.32 v18.49,7.32 | v23.37,12.19 27.03,15.85 29.06,15.85 30.68,17.48 35.15,17.48 | 36.17,42.88 35.97,42.88 34.95,43.89 34.95,52.83 v26.62,52.83 | 36.17,42.88 39.42,42.88 39.83,42.47 LED22.K | v51,49.17 50.6,48.77 v41.66,48.77 | v51.82,37.59 63.8,37.59 66.04,39.83 100.58,39.83 102.21,38.2 LED13.K | v35.15,22.35 35.15,17.48 | v36.17,42.67 36.17,42.88
  Bottom 0.508: v44.7,16.26 47.55,19.1 47.55,20.32 U$12.5 | v1.83,34.95 1.63,34.75 v1.63,13.61 | v23.37,12.19 v18.49,7.32 | LED13.K 102.21,38.2 100.79,39.62 100.79,43.89 GPO5.1 | U$6.7 23.77,59.13 25.4,57.51 25.4,54.05 v26.62,52.83 26.62,38 23.77,35.15 U$9.3 | v41.66,48.77 40.03,47.14 40.03,42.47 LED22.K | U$8.5 47.75,56.49 51,53.24 v51,49.17 51,48.97 51.82,48.16 v51.82,37.59 | v35.15,22.35 35.15,25.2 35.36,25.4 35.36,26.82 36.17,27.64 v36.17,42.67
GPO6  (via drill 0.61)
  Top 0.508: v20.52,29.26 24.38,29.26 26.42,27.23 39.01,27.23 39.01,29.46 38.61,29.87 38.61,32.92 39.83,34.14 LED23.K | v20.52,31.7 18.69,33.53 v18.09,33.53 | v5.28,32.72 8.13,32.72 X2.18 | v5.49,56.29 17.68,56.29 v17.88,56.49 | v18.09,36.37 20.93,36.37 U$9.4 | U$8.6 44.91,57.71 44.5,57.3 35.97,57.3 35.36,57.91 28.45,57.91 28.25,57.71 27.43,57.71 24.18,60.96 21.54,60.96 21.13,60.55 U$6.8 | v114.2,19.51 113.59,18.9 78.64,18.9 | 78.64,18.9 72.14,18.9 69.49,16.26 60.96,16.26 59.33,14.63 v55.07,14.63 | v72.95,24.79 78.64,19.1 78.64,18.9
  Bottom 0.508: v20.52,31.7 v20.52,29.26 | 18.09,56.49 18.09,57.51 20.93,60.35 U$6.8 21.34,60.55 22.76,60.55 25.4,63.2 28.04,63.2 28.04,64.82 32.31,69.09 74.57,69.09 74.57,56.9 72.95,55.27 v72.95,24.79 | 18.09,56.49 v18.09,36.37 v18.09,33.53 | v5.28,32.72 5.49,32.92 v5.49,56.29 | v17.88,56.49 18.09,56.49 | GPO6.1 112.78,43.89 112.78,39.62 114.2,38.2 LED14.K 114.2,37.8 v114.2,19.51 | 50.19,19.3 50.19,20.32 U$12.7 | 50.19,19.3 50.19,8.74 36.58,8.74 LED31.K | v55.07,14.63 50.39,19.3 50.19,19.3
GPO7  (via drill 0.61)
  Top 0.508: v3.25,30.68 7.52,30.68 8.13,30.07 X2.17 | v2.85,58.32 8.13,63.6 v11.18,63.6 | v14.83,49.38 15.65,48.56 21.13,48.56 v25.4,44.3 25.4,44.5 v27.84,46.94 | LED32.K 59.54,18.69 64.82,18.69 66.04,19.91 66.04,20.32 U$13.3 | v57.71,35.15 47.75,35.15 U$10.3 | v58.32,56.49 50.39,56.49 47.75,59.13 U$8.7 | GPO7.1 124.56,44.09 122.94,45.72 79.65,45.72 76.4,42.47 v74.17,42.47 64.01,42.47 LED24.K | v27.84,58.93 28.45,59.54 v37.39,59.54 | v44.7,64.82 v38.61,64.82
  Bottom 0.508: v3.25,30.68 3.05,30.89 3.05,40.03 2.85,40.23 v2.85,58.32 | v11.18,63.6 14.83,59.94 v14.83,49.38 | v25.4,44.3 25.4,39.42 23.77,37.8 U$9.5 | LED15.K 126.19,38.2 124.77,39.62 124.77,43.89 GPO7.1 | 59.23,37.69 57.71,36.17 v57.71,35.15 | 59.23,37.69 63.8,42.27 LED24.K | v58.32,56.49 59.13,55.68 59.13,37.8 59.23,37.69 | v74.17,42.47 74.17,18.69 67.87,18.69 66.24,20.32 U$13.3 | v27.84,58.93 v27.84,46.94 | v37.39,59.54 38.61,60.76 v38.61,64.82 | v44.7,64.82 47.55,61.98 47.55,59.33 U$8.7
GPO8  (via drill 0.61)
  Top 0.508: v7.11,19.51 6.71,19.51 6.71,25.6 8.13,27.03 X2.16 | v9.55,17.07 9.75,17.27 v13.61,17.27 | v40.84,37.19 40.64,37.39 34.75,37.39 | v31.9,37.39 34.75,37.39 | v27.84,41.45 26.21,43.08 17.07,43.08 16.66,42.67 16.46,42.67 15.65,41.86 15.65,39.01 20.93,39.01 U$9.6 | LED33.K 58.93,16.05 60.55,17.68 65.84,17.68 68.48,20.32 U$13.5 | v65.23,56.29 62.99,56.29 60.15,59.13 53.44,59.13 51.61,60.96 45.52,60.96 45.11,60.55 U$8.8 44.91,60.35 44.09,60.35 v42.27,58.52 | v66.65,41.25 133.91,41.25 136.55,43.89 GPO8.1 | v34.95,54.05 36.98,56.08 v39.83,56.08 | v34.75,37.59 34.75,37.39
  Bottom 0.508: v9.55,17.07 v7.11,19.51 | v13.61,17.27 14.02,17.68 14.02,23.77 19.3,29.06 19.3,37.19 20.93,38.81 U$9.6 | v40.84,37.19 40.84,38.61 43.08,38.61 43.89,37.8 43.89,37.39 44.91,36.37 U$10.4 | v27.84,41.45 v31.9,37.39 | LED16.K 138.18,38.2 136.75,39.62 136.75,43.89 GPO8.1 | LED33.K 58.93,16.05 58.93,29.26 63.8,34.14 LED25.K 64.21,34.34 66.45,36.58 66.45,41.25 | v65.23,56.29 66.45,55.07 66.45,41.25 | v66.65,41.25 66.45,41.25 | v34.75,37.59 34.95,37.8 v34.95,54.05 | v42.27,58.52 v39.83,56.08
N$1
  Bottom 0.305: RN1.2 83.92,34.34 85.75,32.51 85.75,9.96 84.73,8.94 79.25,8.94 79.25,17.48 LED1.A
N$2
  Bottom 0.305: RN1.3 86.56,34.34 87.58,33.33 87.58,17.68 LED2.A
N$4
  Bottom 0.305: RN5.2 42.47,52.43 41.05,52.43 40.64,52.02 38.61,52.02 38.61,57.51 39.83,58.73 LED18.A
N$6
  Bottom 0.305: RN1.4 89,34.34 89.81,33.53 89.81,23.98 96.11,17.68 LED3.A
N$9
  Top 0.305: RN5.3 42.47,50.19 42.06,50.6 40.03,50.6 LED19.A
N$10
  Bottom 0.305: RN1.5 91.64,34.54 93.07,34.54 93.07,34.95 93.67,35.56 104.65,35.56 104.65,17.68 LED4.A
N$13  (via drill 0.41)
  Top 0.305: v61.57,50.39 57.71,46.53 43.48,46.53 42.67,47.35 RN5.4
  Bottom 0.305: v61.57,50.39 61.77,50.6 61.77,53.24 63.4,54.86 63.4,58.32 63.8,58.73 LED20.A
N$14
  Bottom 0.305: RN1.6 93.88,34.34 92.46,32.92 90.42,32.92 90.42,34.75 91.85,36.17 113.18,36.17 113.18,17.68 LED5.A
N$15  (via drill 0.41)
  Top 0.305: v118.06,21.34 103.83,35.56 97.74,35.56 96.72,34.54 RN1.7
  Bottom 0.305: v118.06,21.34 121.72,17.68 LED6.A
N$16
  Bottom 0.305: RN1.8 99.16,34.34 103.63,29.87 103.63,10.97 105.66,8.94 130.05,8.94 130.05,17.48 LED7.A
N$17
  Top 0.305: RN5.5 42.47,45.11 41.05,46.53 40.03,46.53 38.81,47.75 38.81,51.82 41.86,51.82 42.67,51 45.72,51 46.53,50.19 51,50.19 53.24,52.43 62.18,52.43 63.8,50.8 LED21.A
N$18
  Top 0.305: RN1.9 101.6,34.34 100.79,33.53 96.11,33.53 95.5,34.14 95.5,35.97 97.33,35.97 97.54,36.17 120.09,36.17 138.58,17.68 LED8.A
N$19  (via drill 0.41)
  Top 0.305: v99.57,59.54 95.5,63.6 79.65,63.6 78.44,64.82 RN2.2
  Bottom 0.305: v99.57,59.54 99.57,56.08 LED9.A
N$20  (via drill 0.41)
  Top 0.305: v83.11,62.79 95.3,62.79 100.79,57.3 110.34,57.3 111.56,56.08 LED10.A
  Bottom 0.305: v83.11,62.79 81.08,64.82 RN2.3
N$21
  Top 0.305: RN5.6 42.47,42.27 40.03,39.83 LED22.A
N$22  (via drill 0.41)
  Top 0.305: v86.77,58.52 90.63,54.66 122.33,54.66 123.55,55.88 LED11.A
  Bottom 0.305: v86.77,58.52 86.77,61.57 83.52,64.82 RN2.4
N$23
  Bottom 0.305: RN2.5 86.16,65.02 88.39,67.26 135.13,67.26 135.13,56.49 135.53,56.08 LED12.A
N$24
  Bottom 0.305: RN2.6 88.59,64.82 90.63,62.79 90.63,43.28 96.32,37.59 99.57,37.59 99.57,38 LED13.A
N$25
  Bottom 0.305: RN5.7 42.47,40.03 41.05,40.03 41.05,40.23 40.44,40.84 38.81,40.84 38.81,37.19 41.25,34.75 41.25,33.12 40.03,31.9 LED23.A
N$26
  Bottom 0.305: RN2.7 91.24,64.82 92.66,63.4 97.13,63.4 98.15,64.41 106.27,64.41 106.27,43.48 111.56,38.2 LED14.A
N$27  (via drill 0.41)
  Top 0.305: v118.67,65.02 117.65,66.04 94.69,66.04 93.67,65.02 RN2.8
  Bottom 0.305: v118.67,65.02 122.73,60.96 122.73,39.01 123.55,38.2 LED15.A
N$28
  Top 0.305: RN2.9 96.32,64.82 96.93,64.21 143.46,64.21 145.09,62.59 145.09,39.22 136.75,39.22 135.74,38.2 LED16.A
N$29  (via drill 0.41)
  Top 0.305: v43.48,32.11 44.5,31.09 50.8,31.09 53.65,33.93 v58.12,33.93
  Bottom 0.305: v43.48,32.11 43.48,36.37 42.67,37.19 RN5.8 | v58.12,33.93 63.8,39.62 LED24.A
N$30
  Bottom 0.305: R5.1 67.87,65.02 70.71,65.02 LED17.A
N$31
  Top 0.305: RN5.9 42.67,34.75 42.67,29.26 54.86,29.26 57.3,31.7 63.8,31.7 LED25.A
N$32
  Top 0.305: RN4.2 21.34,25.81 18.9,23.37 15.65,23.37 LED26.A
N$33  (via drill 0.41)
  Top 0.305: v17.68,21.74 19.71,21.74 23.77,25.81 RN4.3
  Bottom 0.305: v17.68,21.74 16.87,20.93 16.87,18.49 15.65,17.27 LED27.A
N$41  (via drill 0.41)
  Top 0.305: v19.51,22.55 22.15,25.2 22.35,25.2 22.35,25.81 23.57,27.03 25.4,27.03 26.42,26.01 RN4.4
  Bottom 0.305: v19.51,22.55 19.3,22.35 19.3,17.48 17.88,16.05 14.22,16.05 14.22,12.6 15.44,11.38 LED28.A
N$42  (via drill 0.41)
  Top 0.305: v32.72,23.57 32.92,23.37 36.37,23.37 LED29.A
  Bottom 0.305: v32.72,23.57 32.72,24.38 30.48,24.38 29.06,25.81 RN4.5
N$43  (via drill 0.41)
  Top 0.305: v34.75,28.25 35.36,28.85 v38,28.85
  Bottom 0.305: v34.75,28.25 34.75,27.43 33.12,27.43 31.7,26.01 RN4.6 | v38,28.85 38,18.09 35.97,16.05 35.36,16.05 LED30.A
N$44
  Bottom 0.305: RN4.7 34.14,25.81 34.14,15.65 36.37,13.41 36.37,11.38 LED31.A
N$46  (via drill 0.41)
  Top 0.305: v33.12,25.2 33.33,24.99 35.76,24.99 36.58,25.81 RN4.8 | v35.56,13.21 35.76,13.01 39.42,13.01 40.44,11.99 45.92,11.99 51.82,17.88 53.03,17.88 56.08,20.93 56.08,23.16 57.3,23.16 LED32.A
  Bottom 0.305: v33.12,25.2 33.53,24.79 33.53,22.15 33.12,21.74 33.12,15.65 v35.56,13.21
N$47  (via drill 0.41)
  Top 0.305: v47.35,17.27 v38.61,17.27 | v49.17,14.22 51,16.05 56.08,16.05 LED33.A
  Bottom 0.305: v38.61,17.27 38.81,17.48 38.81,25.6 39.01,25.81 RN4.9 | v47.35,17.27 49.17,15.44 v49.17,14.22
VCC  (via drill 0.41)
  Top 0.305: v20.32,47.55 16.26,43.48 15.44,43.48 14.22,42.27 14.22,34.54 20.32,34.54 20.93,33.93 U$9.2 | RN5.1 42.67,55.07 44.91,52.83 U$8.2 | 45.21,24.28 43.89,22.96 U$12.2 | 45.21,24.28 45.31,24.38 63.4,24.38 64.82,22.96 U$13.2 | U$11.2 22.96,22.96 24.38,24.38 45.11,24.38 45.21,24.28 | v68.48,62.59 68.68,62.79 73.76,62.79 75.79,64.82 RN2.1 | GPO1.3 107.9,62.18 109.32,63.6 118.26,63.6 119.69,62.18 GPO2.3 119.89,62.18 121.31,63.6 133.1,63.6 133.2,63.5 | 142.14,45.62 143.66,44.09 GPO8.3 | 142.14,45.62 142.04,45.72 133.5,45.72 131.88,44.09 GPO7.3 | 133.2,63.5 133.3,63.6 142.24,63.6 142.34,63.5 | 133.2,63.5 131.88,62.18 GPO3.3 | 142.34,63.5 143.66,62.18 GPO4.3 | 142.14,45.62 142.24,45.72 142.24,63.4 142.34,63.5 | v70.92,33.93 71.53,34.54 81.28,34.54 RN1.1
  Bottom 0.305: U$11.2 22.76,22.96 21.74,22.96 18.9,25.81 RN4.1 18.9,26.01 21.54,28.65 21.54,33.33 21.13,33.73 U$9.2 | v20.32,47.55 20.32,52.02 20.93,52.63 U$6.2 | 45.31,27.64 45.31,33.53 45.11,33.73 U$10.2 | 45.31,27.64 45.31,24.38 43.89,22.96 U$12.2 | 45.31,27.64 49.17,31.5 49.17,40.84 46.33,43.69 46.33,51.41 45.11,52.63 U$8.2 | v68.48,62.59 66.24,64.82 R5.2 | RN1.1 81.28,34.54 78.03,37.8 78.03,53.24 76.81,54.46 U$5.PWR | RN2.1 76,64.82 76.2,64.62 76.2,55.07 76.61,54.66 U$5.PWR | GPO5.3 107.9,44.09 107.9,61.98 GPO1.3 107.7,62.18 107.7,66.04 88.19,66.04 87.58,65.43 87.58,53.44 78.03,53.44 U$5.PWR | GPO6.3 119.89,44.09 119.89,61.98 GPO2.3 | v70.92,33.93 70.92,28.85 65.02,22.96 U$13.2

### Text on the board
_bsilk: SKAARHOJ 2013 | PCB-ATEM-GPITBO2 v12-13